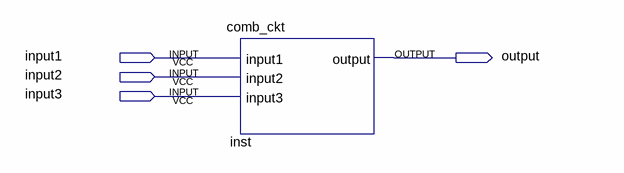
[diagram p0: schematic sheet]
// Quartus schematic top.bdf as structural Verilog: 1 symbols, 4 pins
module top (
  input  input1,
  input  input2,
  input  input3,
  output \output 
);

  comb_ckt inst (.input1(input1), .input2(input2), .input3(input3), .\output (\output ));
endmodule
